# EAGLE design sensor calibration board (EAGLE 9.4.1)
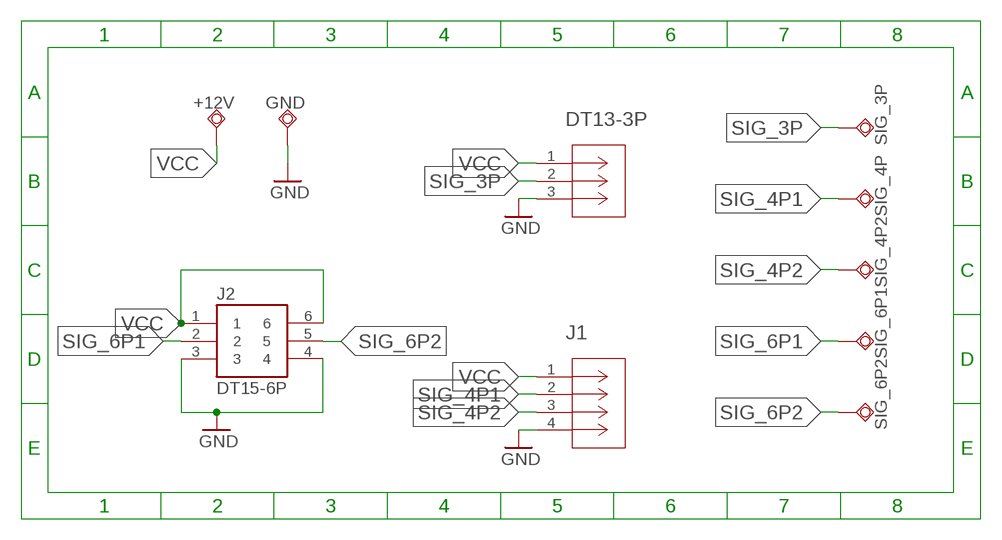
[diagram p0: schematic, sheet 1]

## Parts
+12V  TPSQPAD1-20Y  [P1-20Y]
DT13-3P  DTF13-3P  [CONN3_DTF13-3P]
GND  TPSQPAD1-20Y  [P1-20Y]
J1  DT15-4P-G003S  DT15-4P-G003  [CONN4_DT15-4P-G003]
J2  DT15-6P  [TE_DT15-6P]
SIG_3P  TPSQPAD1-20Y  [P1-20Y]
SIG_4P  TPSQPAD1-20Y  [P1-20Y]
SIG_4P2  TPSQPAD1-20Y  [P1-20Y]
SIG_6P1  TPSQPAD1-20Y  [P1-20Y]
SIG_6P2  TPSQPAD1-20Y  [P1-20Y]

## Nets
GND: DT13-3P.3 GND.1(TP) J1.4 J2.3 J2.4
SIG_3P: DT13-3P.2 SIG_3P.1(TP)
SIG_4P1: J1.2 SIG_4P.1(TP)
SIG_4P2: J1.3 SIG_4P2.1(TP)
SIG_6P1: J2.2 SIG_6P1.1(TP)
SIG_6P2: J2.5 SIG_6P2.1(TP)
VCC: +12V.1(TP) DT13-3P.1 J1.1 J2.1 J2.6

## Library data of the parts
+12V GND SIG_3P SIG_4P SIG_4P2 SIG_6P1 SIG_6P2 = testpad:TPSQ: Test pad
DT13-3P = deutsch_headers:DTF13-3P: DTF13-3P; BUILT_BY: EMA_Justin; COPYRIGHT: Copyright (C) 2016 Accelerated Designs. All rights reserved; DATASHEET: https://www.te.com/commerce/DocumentDelivery/DDEController?Action=srchrtrv&DocNm=DTF13-3P&DocType=Customer+Drawing&DocLang=English&DocFormat=pdf&PartCntxt=DTF13-3P; DESCRIPTION: DTF RECP ASM; MANUFACTURER_PART_NUMBER: DTF13-3P; PITCH_MM_: 0.171; POSITIONS: 3; PRODUCT: -; ROWS-CONFIG: 3; TE_PART_NUMBER: DTF13-3P; TYPE: -; VENDOR: TE Connectivity
J1 = deutsch_headers:DT15-4P-G003: DT15-4P-G003; BUILT_BY: EMA_UL_Team; COPYRIGHT: Copyright (C) 2018 Accelerated Designs. All rights reserved; DATASHEET: https://www.te.com/commerce/DocumentDelivery/DDEController?Action=showdoc&DocId=Customer+Drawing%7FDT15-4P-G003%7FA1%7Fpdf%7FEnglish%7FENG_CD_DT15-4P-G003_A1_pdf_dt15-4p-g003-env_drw.pdf%7FDT15-4P-G003; DESCRIPTION: DT RECP ASM; MANUFACTURER_PART_NUMBER: DT15-4P-G003; PITCH_MM_: 0.175; POSITIONS: 4; PRODUCT: -; ROWS-CONFIG: 2; TE_PART_NUMBER: DT15-4P-G003; TYPE: -; VENDOR: TE Connectivity
J2 = deutsch_headers:DT15-6P: DT15 Series, 4.44mm Pitch 6 Way 2 Row Straight PCB Header, Solder Termination; AVAILABILITY: Unavailable; COMMENT: DT15-6P; DESCRIPTION: DT15 Series, 4.44mm Pitch 6 Way 2 Row Straight PCB Header, Solder Termination; MAXIMUM_PACKAGE_HEIGHT: 15.75mm; MF: TE Connectivity; MP: DT15-6P; PACKAGE: None; PARTREV: C1; PRICE: None; STANDARD: IPC-7351B; TE_PURCHASE_URL: https://www.te.com/usa-en/product-DT15-6P.html?te_bu=Cor&te_type=disp&te_campaign=seda_glo_cor-seda-global-disp-prtnr-fy19-seda-model-bom-cta_sma-317_1&elqCampaignId=32493

## Board
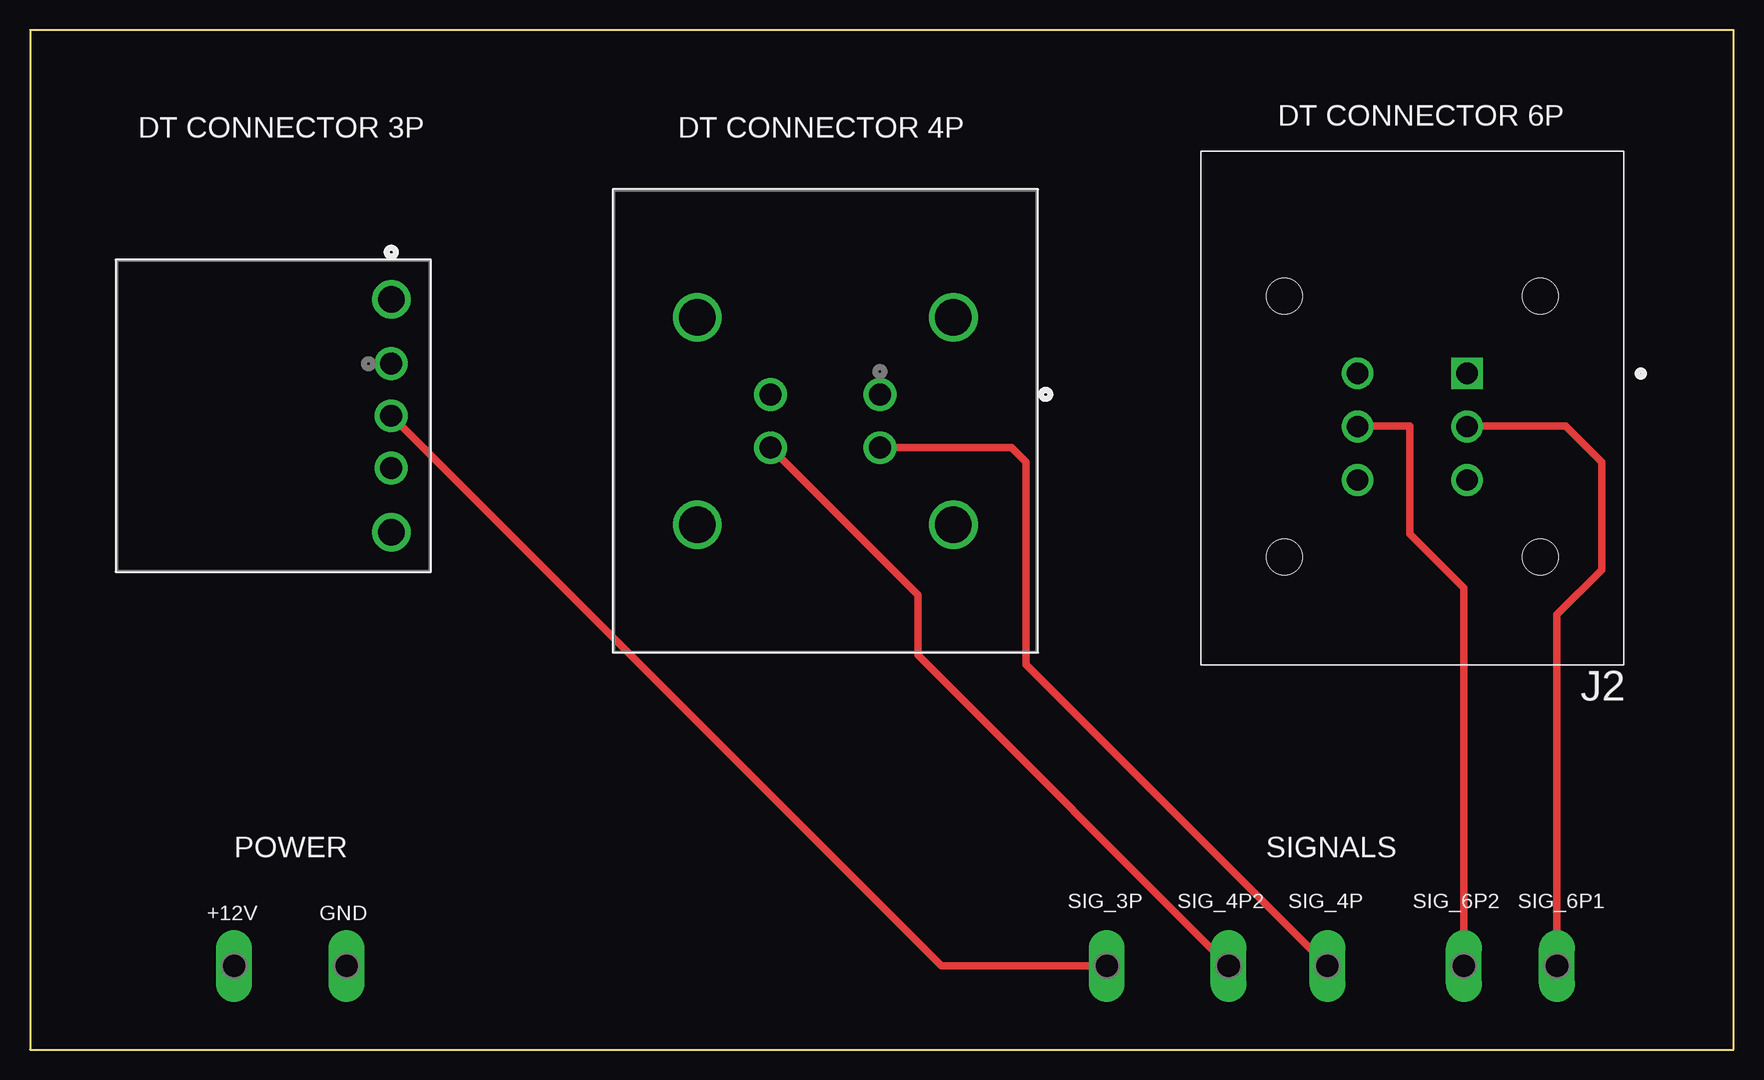
[diagram p1: board, top side]
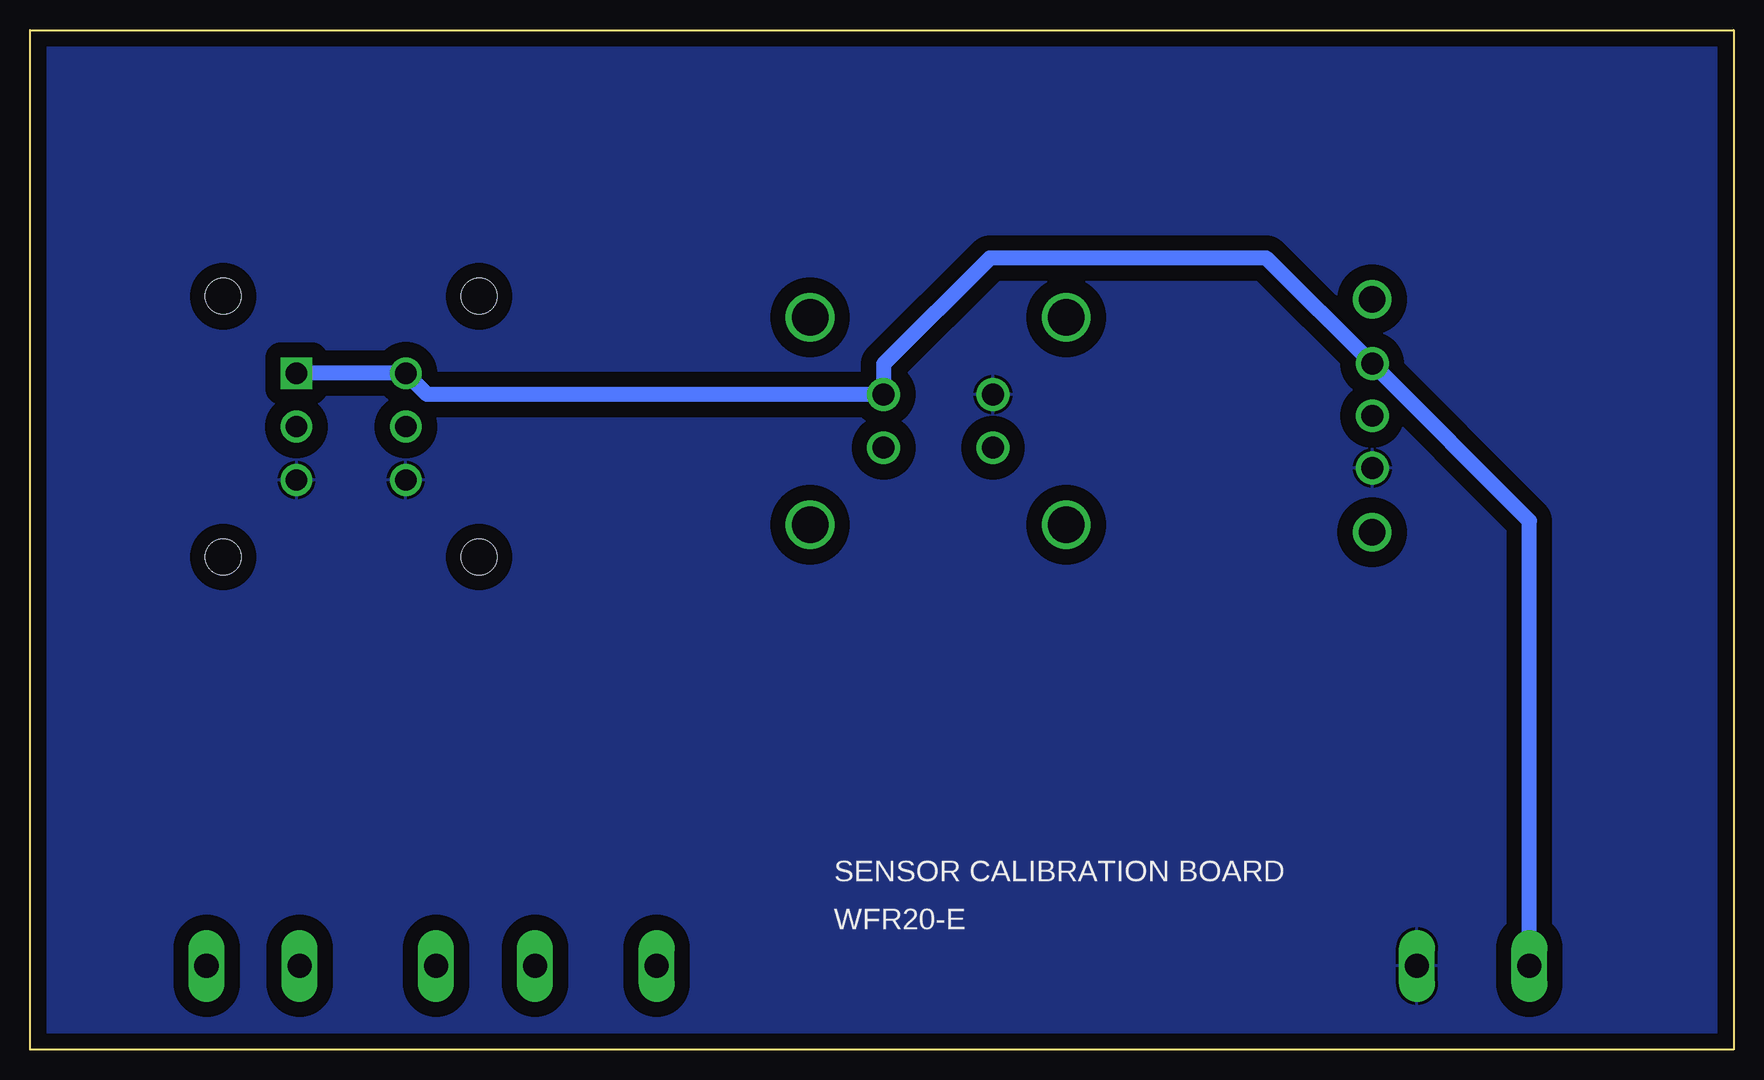
[diagram p2: board, bottom side, seen from below]

Size 142 x 85 mm. Coordinates in mm from the lower left corner, seen from the top.
Outline: 0,0 142,0 142,85 0,85 0,0
Copper layers (1*16): Top 0.035mm / dielectric 1.5mm / Bottom 0.035mm
Design rules "default": minimum track width 6mil, minimum drill 0.35mm, track to track 6mil, track to pad 6mil, pad to pad 6mil, via to via 6mil, smd to smd 6mil, copper to edge 40mil, drill to drill 6mil, minimum pad ring 10mil, minimum via ring 8mil, stop-mask expansion 4mil, vias tented up to drill 0mil, thermal gap 10mil

### Footprints (pad centres in the part's own frame; a part is rotated, then mirrored left to right if it is on the bottom)
P1-20Y = drill 2.007 pad 2.54 long: 1 0,0
CONN3_DTF13-3P = drill 1.829 pad 2.337: 1 8.687,0; 2 4.343,0; 3 0,0 | drill 2.21 pad 2.21: 4 -5.359,0; 5 14.046,0
CONN4_DT15-4P-G003 = drill 1.829 pad 2.337: 1 -9.119,-4.445; 2 -9.119,0; 3 0,0; 4 0,-4.445 | drill 3.048 pad 3.048: 5 -15.24,6.426; 6 6.096,6.426; 7 -15.24,-10.871; 8 6.096,-10.871
TE_DT15-6P = drill 1.77 square: 1 -4.56,-4.45 | drill 1.77: 2 -4.56,0; 3 -4.56,4.45; 4 4.56,4.45; 5 4.56,0; 6 4.56,-4.45 | hole 2.99: 10.67,10.87; 10.67,-10.87; -10.67,-10.87; -10.67,10.87

### Placement (x,y rotation side)
+12V  17.01,6.97 0 top
DT13-3P  30.12,48.49 90 top
GND  26.39,6.97 0 top
J1  61.73,50.17 180 top
J2  115.23,51.93 180 top
SIG_3P  89.77,6.97 0 top
SIG_4P  108.15,6.97 0 top
SIG_4P2  99.91,6.97 0 top
SIG_6P1  127.29,6.97 0 top
SIG_6P2  119.53,6.97 0 top

### Tracks (layer width: path | path; a pad name or v marks a point on that pad's centre or on a via)
GND
  pour Bottom (isolate 1.27): 0,0 142,0 142,85 0,85
SIG_3P
  Top 0.61: SIG_3P.1 75.98,6.97 DT13-3P.2
SIG_4P1
  Top 0.61: SIG_4P.1 83,32.12 83,49 81.83,50.17 J1.2
SIG_4P2
  Top 0.61: SIG_4P2.1 74,32.88 74,37.9 J1.3
SIG_6P1
  Top 0.61: SIG_6P1.1 127.29,36.29 131,40 131,49 128,52 119.86,52 J2.2
SIG_6P2
  Top 0.61: SIG_6P2.1 119.53,38.47 115,43 115,52 110.74,52 J2.5
VCC
  Bottom 1.27: +12V.1 17.01,44.07 DT13-3P.1 38.94,66 62,66 70.85,57.15 J1.1 108.91,54.62 J2.6 J2.1

### Text on the board
tPlace: DT CONNECTOR 6P | DT CONNECTOR 3P | DT CONNECTOR 4P | POWER | SIGNALS
bPlace: SENSOR CALIBRATION BOARD | WFR20-E